# EAGLE design ProbeEPS_r1.0 (EAGLE 5.00)
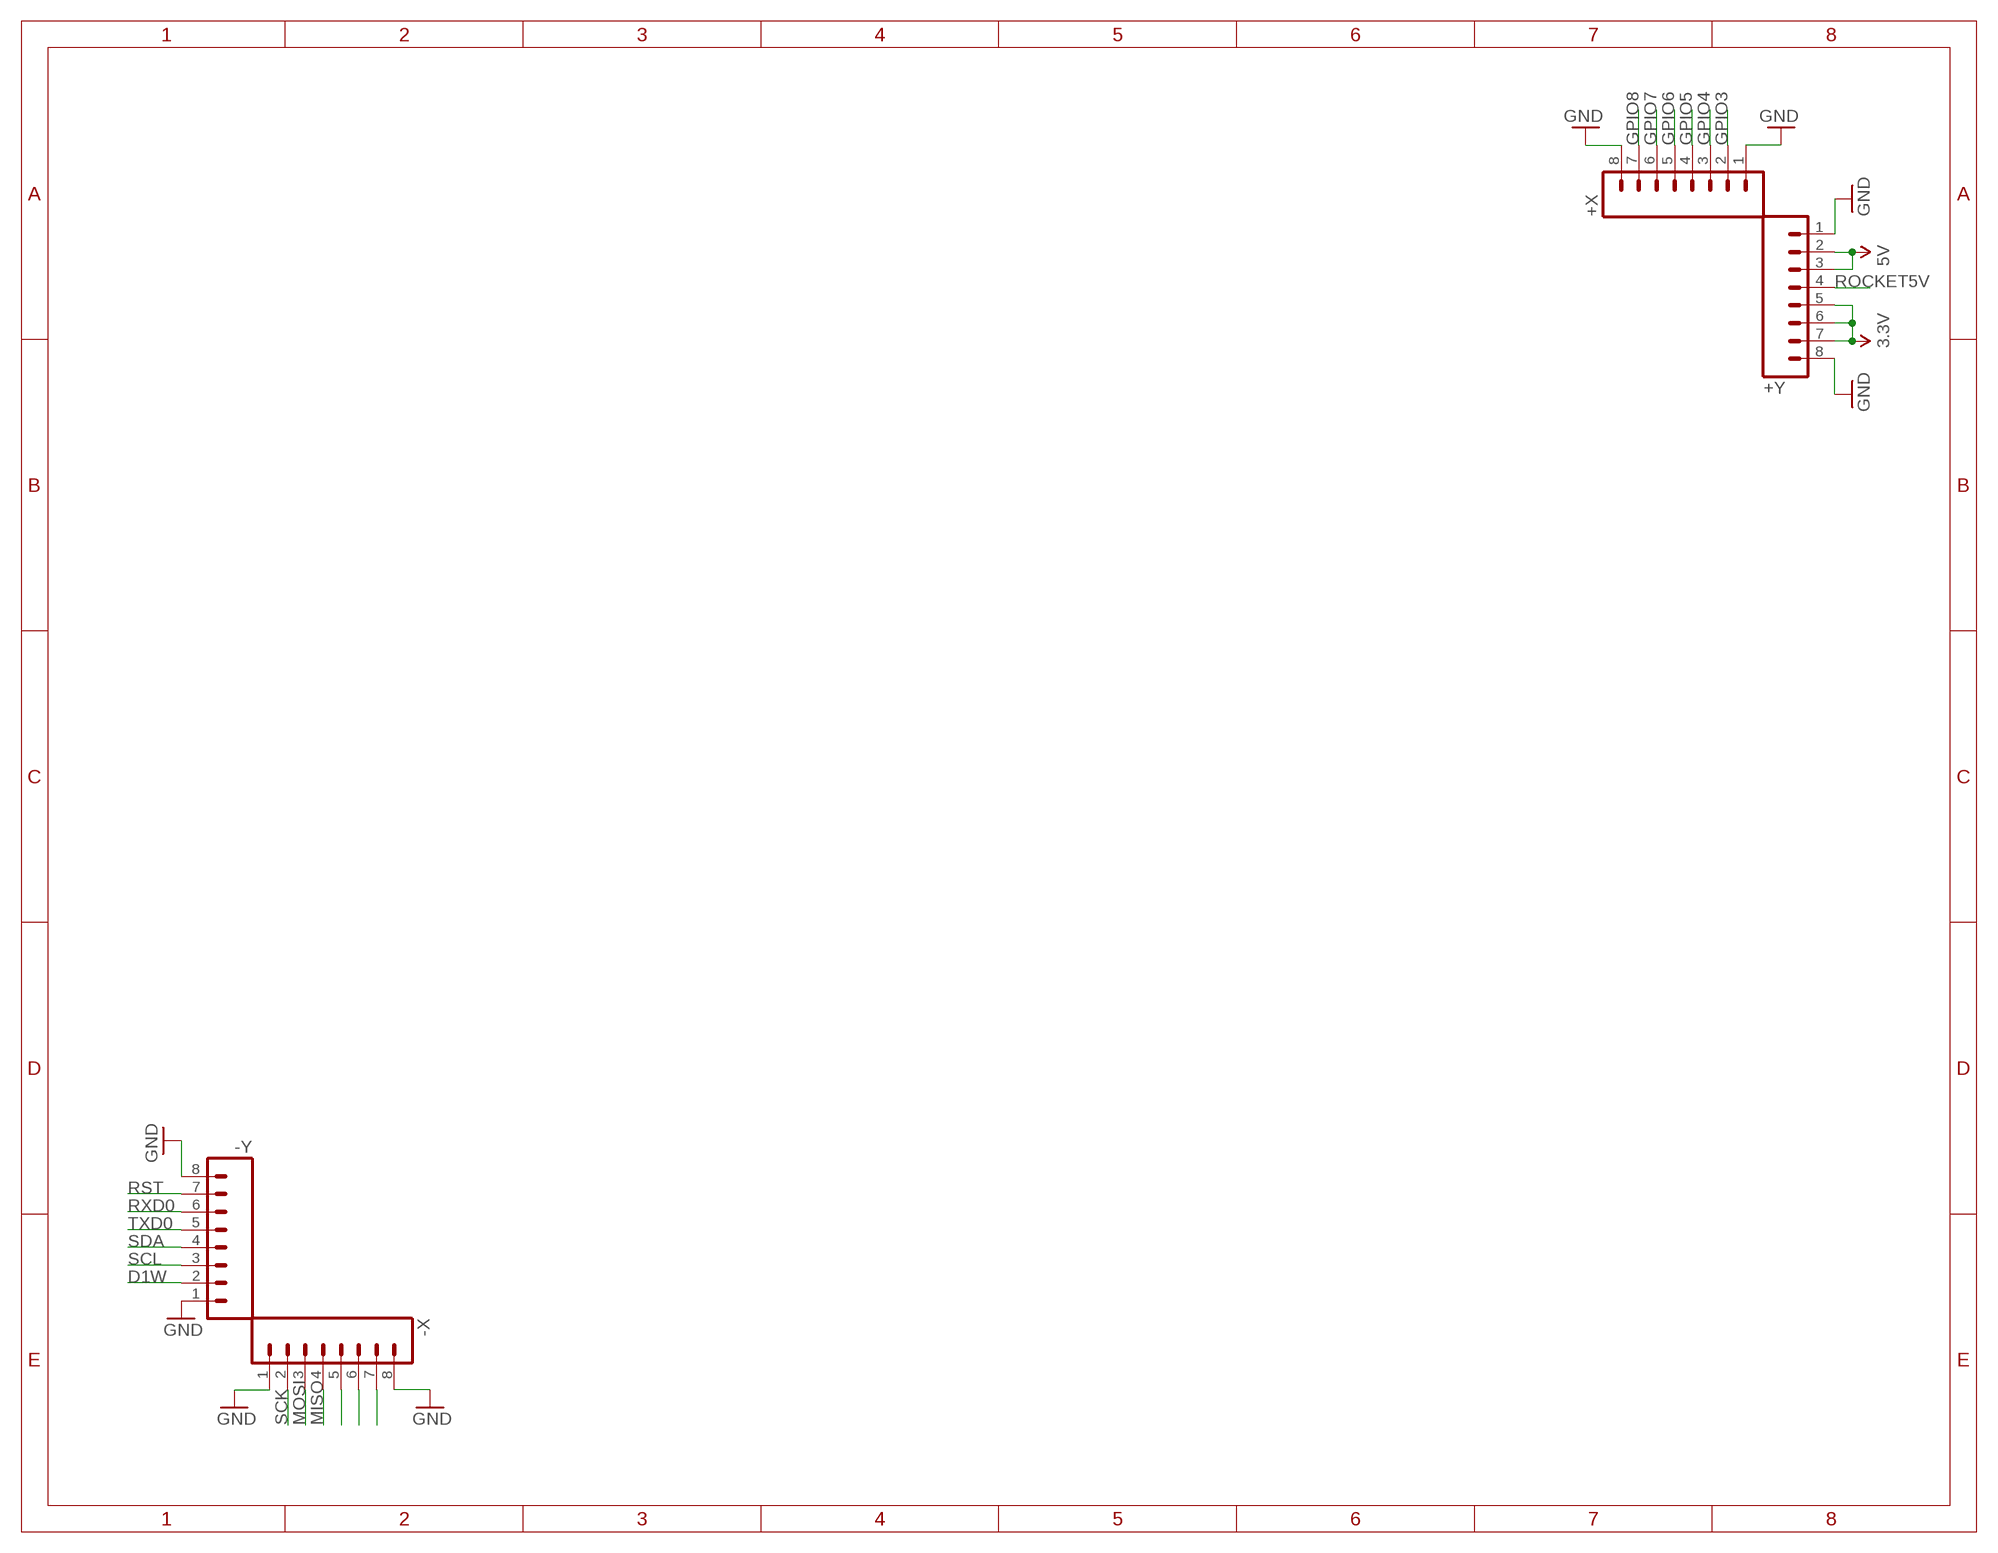
[diagram p0: schematic, sheet 1]

## Parts
+X  M08  [1X08]
+Y  M08  [1X08]
-X  M08  [1X08]
-Y  M08  [1X08]

## Nets
3.3V: +Y.5 +Y.6 +Y.7
5V: +Y.2 +Y.3
D1W: -Y.2
GND: +X.1 +X.8 +Y.1 +Y.8 -X.1 -X.8 -Y.1 -Y.8
GPIO0: -X.7
GPIO1: -X.6
GPIO2: -X.5
GPIO3: +X.2
GPIO4: +X.3
GPIO5: +X.4
GPIO6: +X.5
GPIO7: +X.6
GPIO8: +X.7
MISO: -X.4
MOSI: -X.3
ROCKET5V: +Y.4
RST: -Y.7
RXD0: -Y.6
SCK: -X.2
SCL: -Y.3
SDA: -Y.4
TXD0: -Y.5

## Library data of the parts
+X +Y -X -Y = SparkFun:M08: Header 8 Standard 8-pin 0.1" header. Use with straight break away headers (SKU : PRT-00116), right angle break away headers (PRT-00553), swiss pins (PRT-00743), machine pins (PRT-00117), and female headers (PRT-00115).

## Board
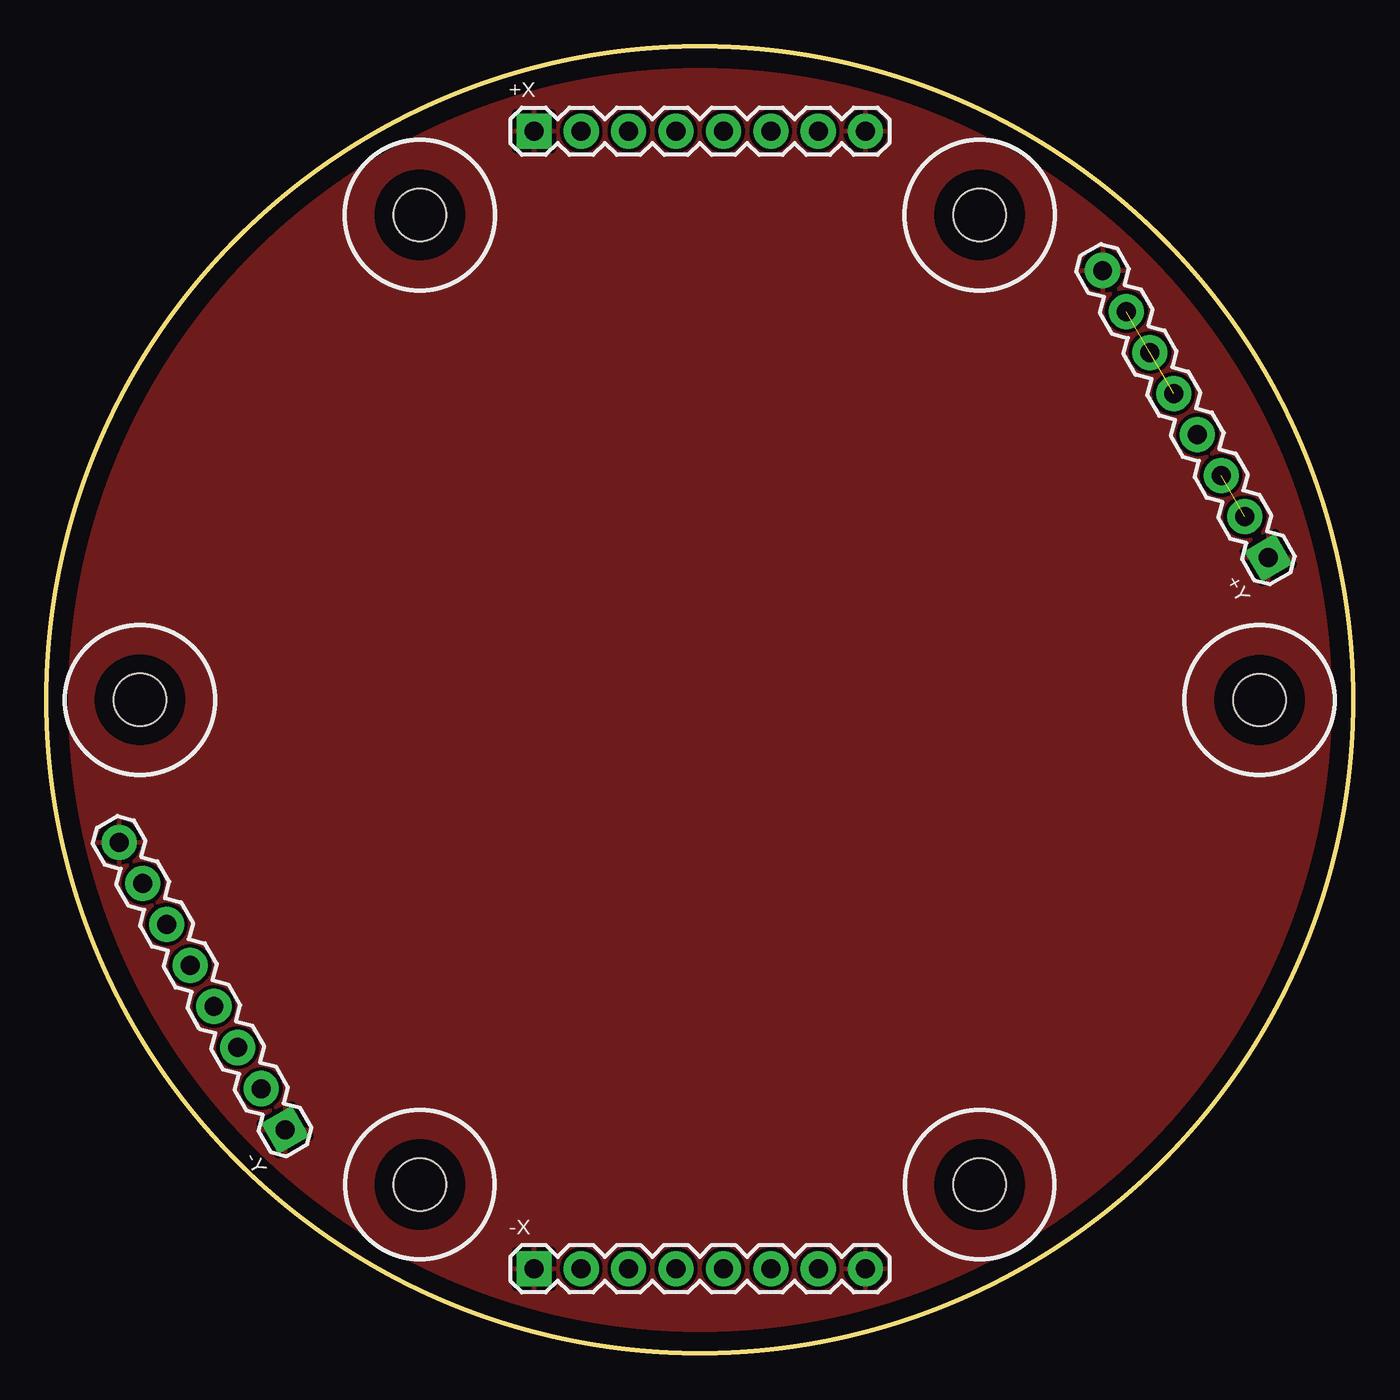
[diagram p1: board, top side]
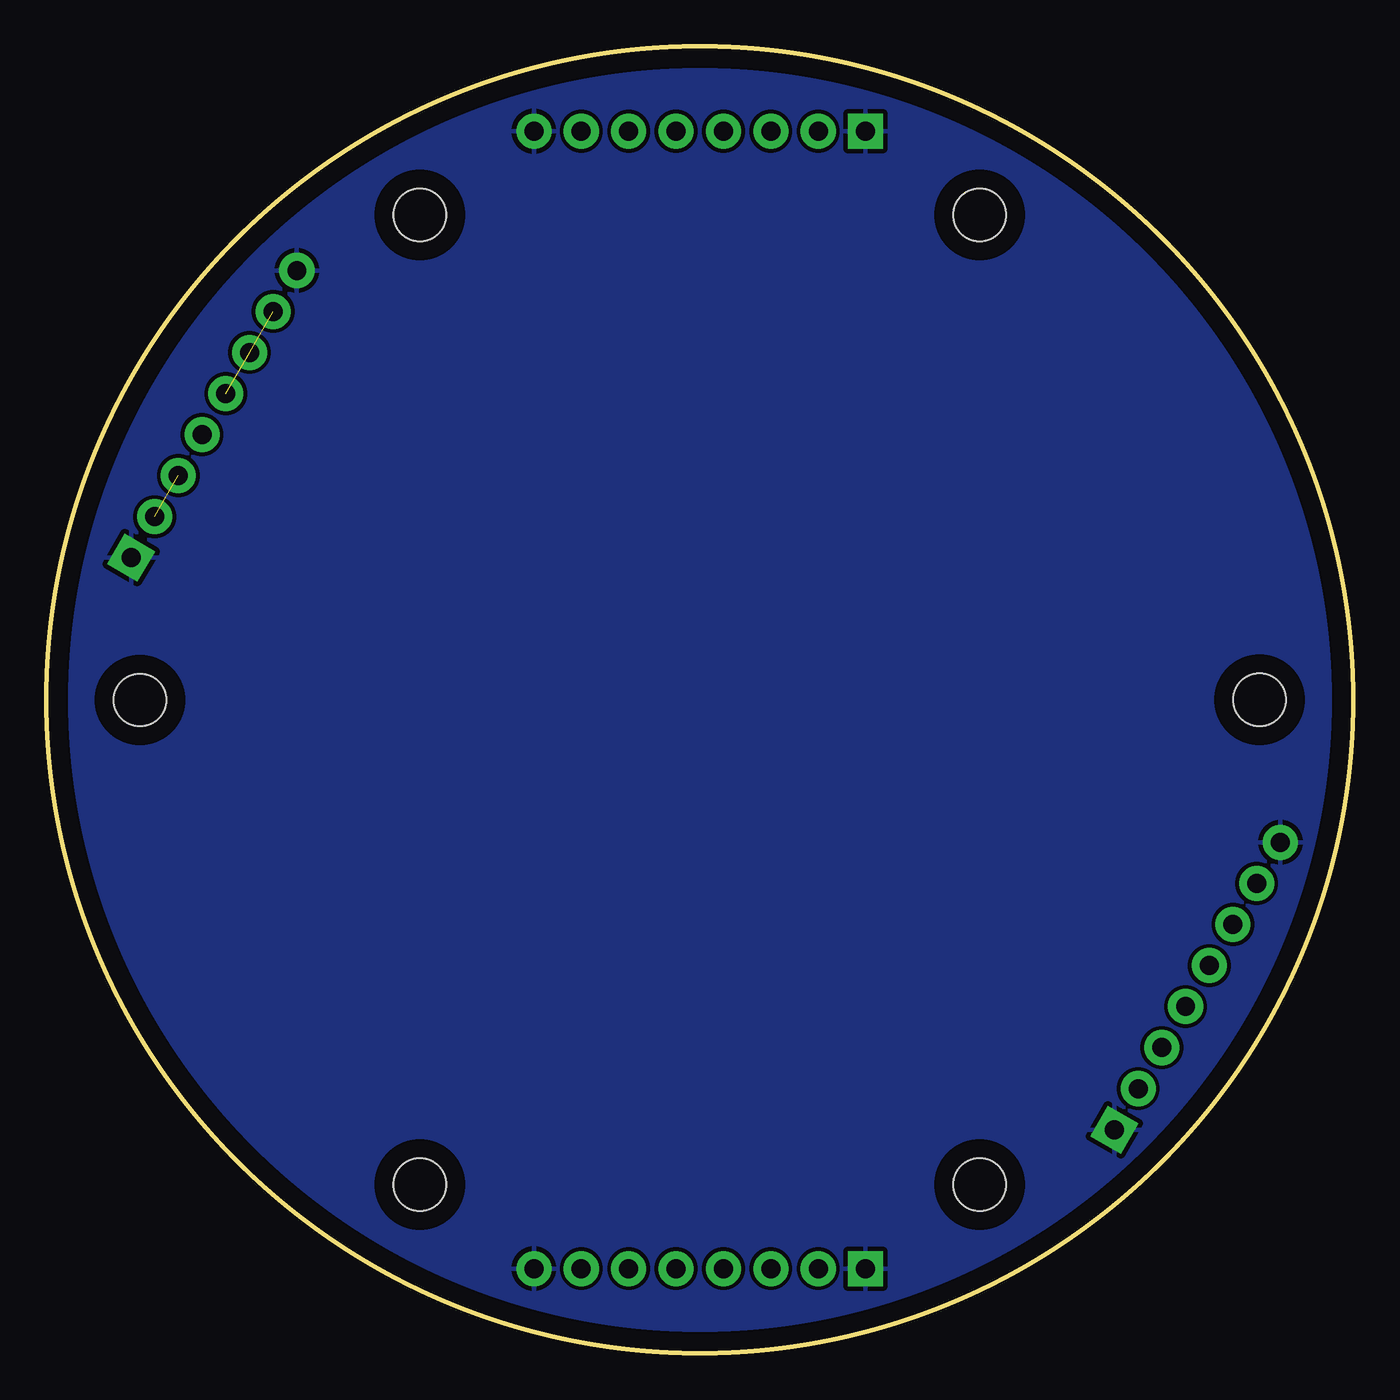
[diagram p2: board, bottom side, seen from below]

Size 70 x 70 mm. Coordinates in mm from the lower left corner, seen from the top.
Outline: circle at 35,35 radius 35
Copper layers (1*16): Top 0.035mm / dielectric 1.5mm / Bottom 0.035mm
Design rules "default *": minimum track width 8mil, minimum drill 24mil, track to track 8mil, track to pad 8mil, pad to pad 8mil, via to via 8mil, smd to smd 8mil, copper to edge 40mil, drill to drill 8mil, minimum pad ring 10mil, minimum via ring 8mil, stop-mask expansion 4mil, vias tented up to drill 0mil, thermal gap 10mil
Holes 2.8 mm at 5,35 65,34.99 50,60.98 50,9.02 20,9.02 20,60.98

### Footprints (pad centres in the part's own frame; a part is rotated, then mirrored left to right if it is on the bottom)
1X08 = drill 1.016 pad 1.88 square: 1 0,0 | drill 1.016 pad 1.88 round: 2 2.54,0; 3 5.08,0; 4 7.62,0; 5 10.16,0; 6 12.7,0; 7 15.24,0; 8 17.78,0

### Placement (x,y rotation side)
+X  26.11,65.47 0 top
+Y  65.48,42.61 120 top
-X  26.11,4.51 0 top
-Y  12.77,11.96 120 top

### Tracks (layer width: path | path; a pad name or v marks a point on that pad's centre or on a via)
3.3V  (2 unrouted)
5V  (1 unrouted)
GND
  pour Top: -0.31,70.3 -0.31,-0.32 70.31,-0.32 70.31,70.3
  pour Bottom: -0.31,70.3 -0.31,-0.32 70.31,-0.32 70.31,70.3